# EAGLE design Haptic_Motor_Driver_DRV2605L (EAGLE 7.5.0)
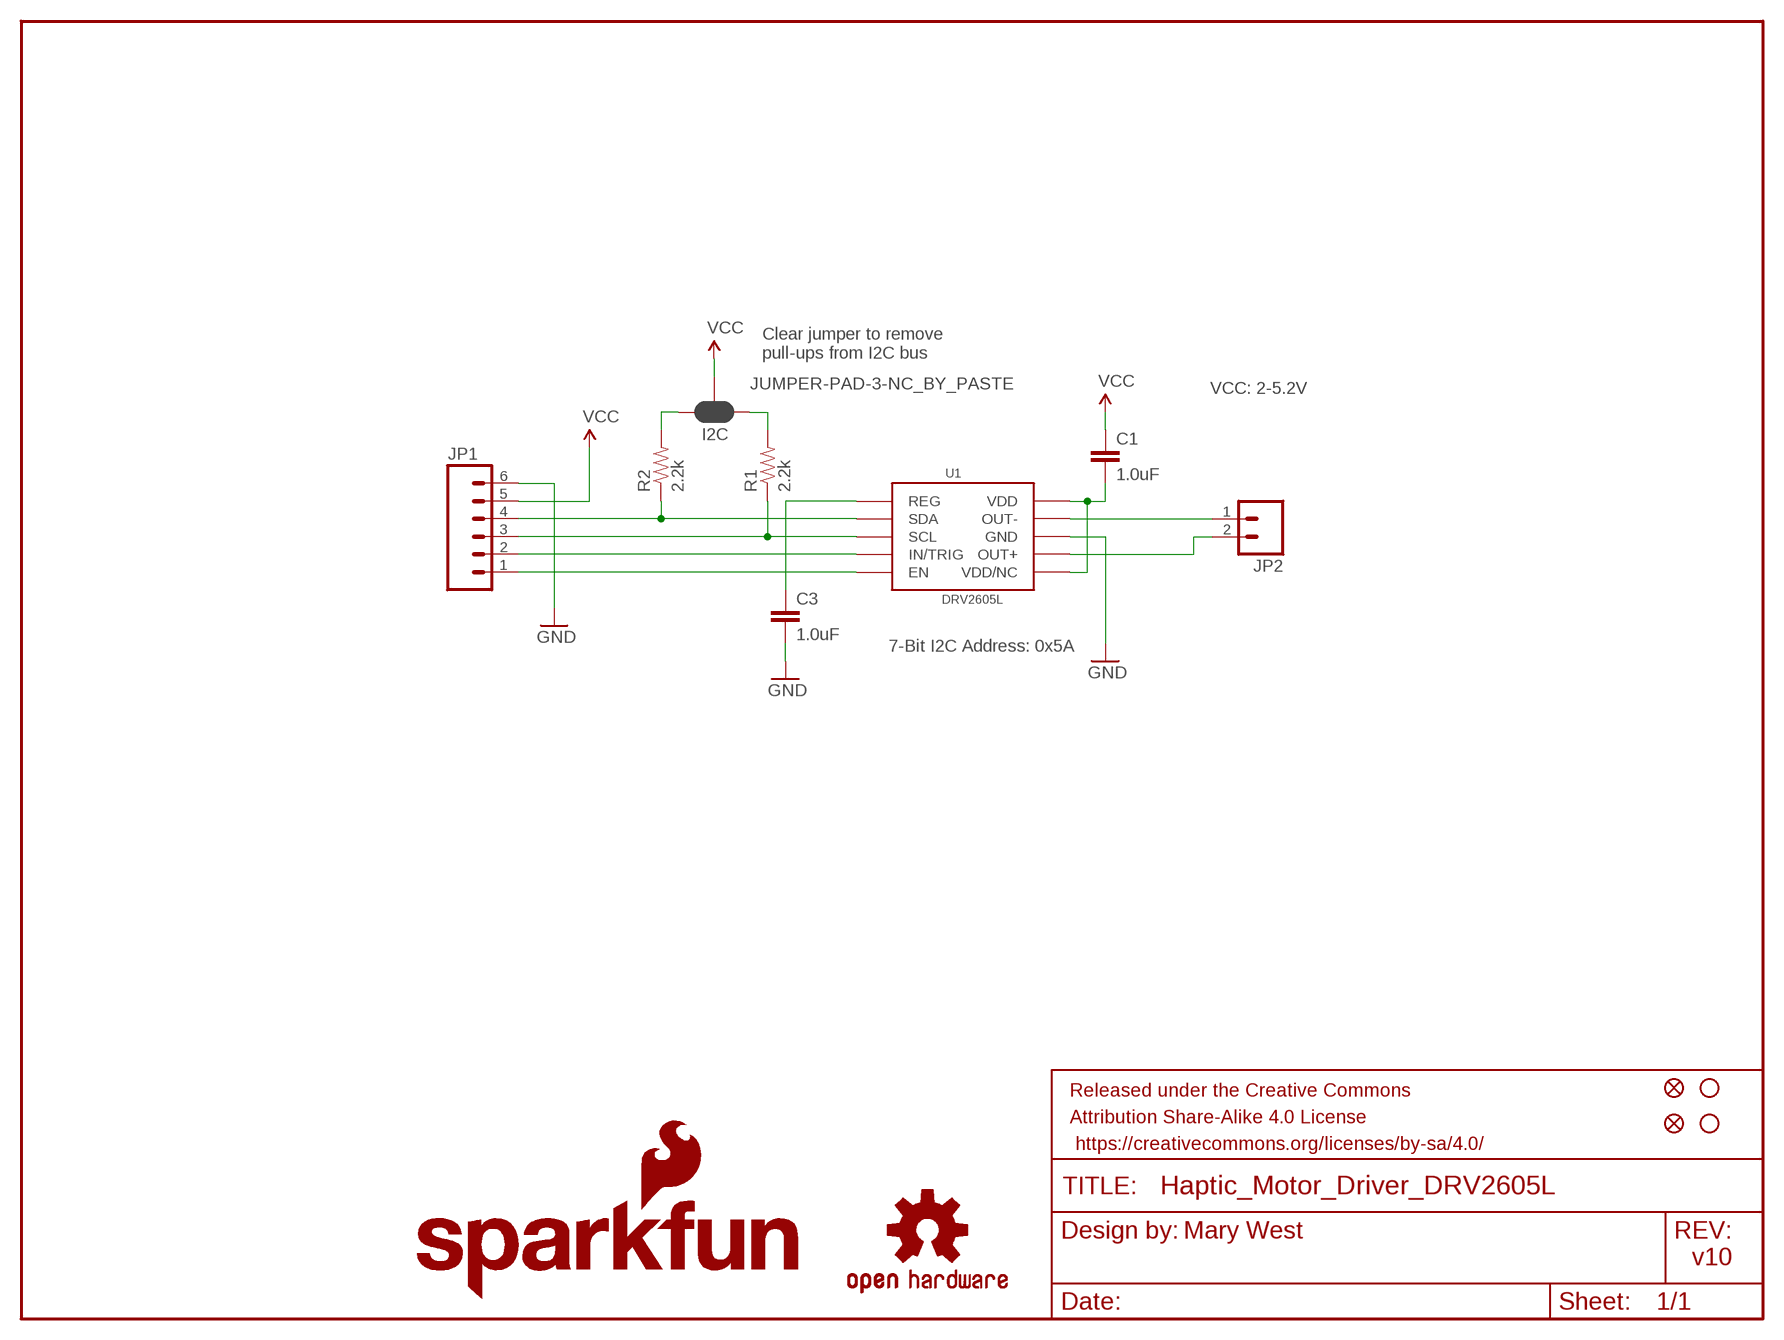
[diagram p0: schematic, sheet 1]

## Parts
C1  1.0uF  1.0UF-16V-10%(0402)  [0402-CAP]
C3  1.0uF  1.0UF-16V-10%(0402)  [0402-CAP]
FID1  FIDUCIAL1X2  [FIDUCIAL-1X2]
FID2  FIDUCIAL1X2  [FIDUCIAL-1X2]
FRAME2  FRAME-LETTER  [CREATIVE_COMMONS]
I2C  JUMPER-PAD-3-NC_BY_PASTE  [PAD-JUMPER-3-NC_BY_PASTE_YES_SILK_FULL_BOX]
JP1  M06SILK_FEMALE_PTH  [1X06]
JP2  M02PTH  [1X02]
LOGO2  OSHW-LOGOS  [OSHW-LOGO-S]
LOGO4  SFE_LOGO_NAME_FLAME.1_INCH  [SFE_LOGO_NAME_FLAME_.1]
R1  2.2k  2.2KOHM-1/10W-1%(0603)  [0603-RES]
R2  2.2k  2.2KOHM-1/10W-1%(0603)  [0603-RES]
STANDOFF1  STAND-OFF  [STAND-OFF]
STANDOFF4  STAND-OFF  [STAND-OFF]
U1  DRV2605L  [VSSOP-10]

## Nets
GND: C3.2 JP1.6 U1.P$8(GND)
N$1: JP1.4 R2.1 U1.P$3(SDA)
N$2: JP1.3 R1.1 U1.P$2(SCL)
N$3: C3.1 U1.P$1(REG)
N$4: JP1.2 U1.P$4(IN/TRIG)
N$5: JP1.1 U1.P$5(EN)
N$6: JP2.1 U1.P$9(OUT-)
N$7: JP2.2 U1.P$7(OUT+)
N$8: I2C.3 R2.2
N$9: I2C.1 R1.2
N$10: C1.2 U1.P$6(VDD/NC) U1.P$10(VDD)
VCC: C1.1 I2C.2 JP1.5

## Notes on the sheet
- Clear jumper to remove
  pull-ups from I2C bus
- VCC: 2-5.2V
- 7-Bit I2C Address: 0x5A
- Mary West
- v10

## Library data of the parts
C1 C3 = SparkFun-Capacitors:1.0UF-16V-10%(0402); PROD_ID: CAP-12417
FID1 FID2 = SparkFun-Aesthetics:FIDUCIAL: Fiducial Alignment Points Various fiducial points for machine vision alignment.
FRAME2 = SparkFun-Aesthetics:FRAME-LETTER: Schematic Frame Standard 8.5x11 US Letter frame
I2C = SparkFun-Passives:JUMPER-PAD-3-NC_BY_PASTE
JP1 = SparkFun-Connectors:M06: Header 6 Standard 6-pin 0.1" header. Use with straight break away headers (SKU : PRT-00116), right angle break away headers (PRT-00553), swiss pins (PRT-00743), machine pins (PRT-00117), and female headers (PRT-00115). Molex polarized connector foot print use with SKU : PRT-08094 with associated crimp pins and housings. NOTES ON THE VARIANTS LOCK and LOCK_LONGPADS... This footprint was designed to help hold the alignment of a through-hole component (i.e. 6-pin header) while soldering it into place. You may notice that each hole has been shifted either up or down by 0.005 of an inch from it's more standard position (which is a perfectly straight line). This slight alteration caused the pins (the squares in the middle) to touch the edges of the holes. Because they are alternating, it causes a "brace" to hold the component in place. 0.005 has proven to be the perfect amount of "off-center" position when using our standard breakaway headers. Although looks a little odd when you look at the bare footprint, once you have a header in there, the alteration is very hard to notice. Also,if you push a header all the way into place, it is covered up entirely on the bottom side. This idea of altering the position of holes to aid alignment will be further integrated into the Sparkfun Library for other footprints. It can help hold any component with 3 or more connection pins.; PROD_ID: CONN-08437
JP2 = SparkFun-Connectors:M02: Standard 2-pin 0.1" header. Use with - straight break away headers ( PRT-00116) - right angle break away headers (PRT-00553) - swiss pins (PRT-00743) - machine pins (PRT-00117) - female headers (PRT-00115) Molex polarized connector foot print use with: PRT-08233 with associated crimp pins and housings. 2.54_SCREWTERM for use with PRT-10571. 3.5mm Screw Terminal footprints for PRT-08084 5mm Screw Terminal footprints for use with PRT-08432
LOGO2 = SparkFun-Aesthetics:OSHW-LOGO: Open Source Hardware Logo This logo indicates the piece of hardware it is found on incorporates a OSHW license and/or adheres to the definition of open source hardware found here: http://freedomdefined.org/OSHW
LOGO4 = SparkFun-Aesthetics:SFE_LOGO_NAME_FLAME: SFE Logo, name and flame This is the SparkFun full logo. The logo on the schematic will always be the same size; the package variant is the height of the flame part of the logo. Default layer for the logo on the board is tSilk.
R1 R2 = SparkFun-Resistors:2.2KOHM-1/10W-1%(0603): RES-08272; PROD_ID: RES-08272
STANDOFF1 STANDOFF4 = SparkFun-Electromechanical:STAND-OFF: #4 Stand Off This is the mechanical footprint for a #4 phillips button head screw. Use the keepout ring to avoid running the screw head into surrounding components. SKU : PRT-00447
U1 = SparkFun-PowerIC:DRV2605L; PROD_ID: IC-13504

## Net classes
1 power: width 0.102 mm

## Board
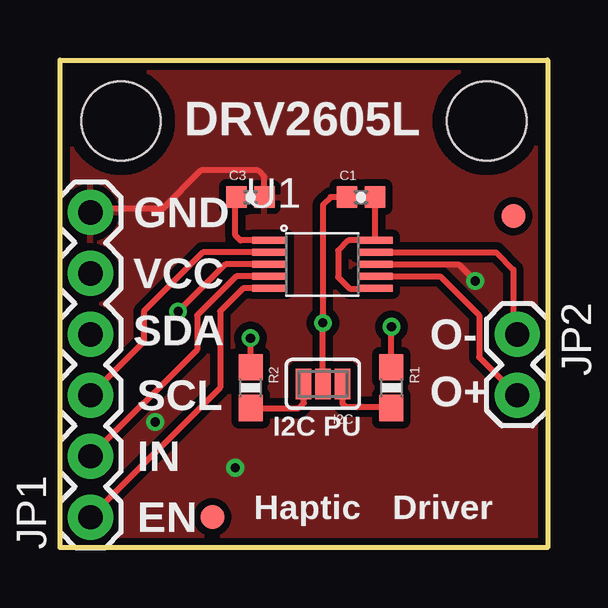
[diagram p1: board, top side]
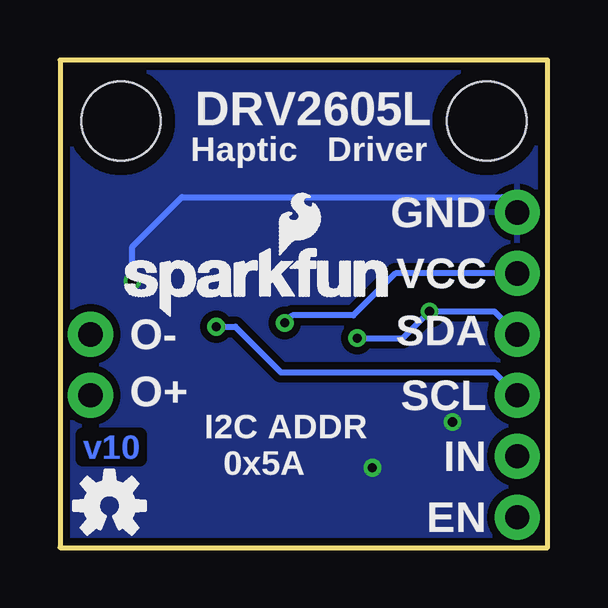
[diagram p2: board, bottom side, seen from below]

Size 20.32 x 20.32 mm. Coordinates in mm from the lower left corner, seen from the top.
Outline: 20.32,0 0,0 0,20.32 20.32,20.32 20.32,0
Copper layers (1*16): Top 0.035mm / dielectric 1.5mm / Bottom 0.035mm
Design rules "SparkFun-2-layer-TIGHT": minimum track width 7mil, minimum drill 15mil, track to track 7mil, track to pad 7mil, pad to pad 7mil, via to via 7mil, smd to smd 7mil, copper to edge 7mil, drill to drill 7mil, minimum pad ring 7mil, minimum via ring 7mil, stop-mask expansion 4mil, vias tented up to drill 25mil, thermal gap 10mil

### Footprints (pad centres in the part's own frame; a part is rotated, then mirrored left to right if it is on the bottom)
0402-CAP = smd 0.85 x 0.9: 1 -0.58,0; 2 0.58,0
FIDUCIAL-1X2 = smd 1 x 1: 1 0,0
PAD-JUMPER-3-NC_BY_PASTE_YES_SILK_FULL_BOX = smd 0.635 x 1.27: 1 -0.813,0; 2 0,0; 3 0.813,0
1X06 = drill 1.016 pad 1.88: 1 0,0; 2 2.54,0; 3 5.08,0; 4 7.62,0; 5 10.16,0; 6 12.7,0
1X02 = drill 1.016 pad 1.88: 1 0,0; 2 2.54,0
0603-RES = smd 1.1 x 1: 1 -0.85,0; 2 0.85,0
STAND-OFF = hole 3.302: 0,0
VSSOP-10 = smd 1.45 x 0.3: P$1 -1.905,1.06; P$2 -1.905,0.56; P$3 -1.905,0.06; P$4 -1.905,-0.44; P$5 -1.905,-0.94; P$6 2.495,-0.94; P$7 2.495,-0.44; P$8 2.495,0.06; P$9 2.495,0.56; P$10 2.495,1.06

### Placement (x,y rotation side)
C1  12.54,14.61 0 top
C3  7.94,14.61 0 top
FID1  6.35,1.27 0 top
FID2  18.89,13.81 0 top
FRAME2  -12.7,-13.97 0 top  (outside the outline)
I2C  10.95,6.83 180 top
JP1  1.27,1.27 90 top
JP2  19.05,8.89 270 top
LOGO2  18.26,1.75 0 bottom
LOGO4  18.03,9.56 0 bottom
R1  13.81,6.67 270 top
R2  7.94,6.67 270 top
STANDOFF1  17.78,17.78 0 top
STANDOFF4  2.54,17.78 0 top
U1  10.64,11.75 0 top

### Tracks (layer width: path | path; a pad name or v marks a point on that pad's centre or on a via)
GND  (via drill 0.38)
  Top 0.254: U1.P$8 16.61,11.81 v17.3,11.11 | C3.2 8.52,15.45 8.26,15.72 5.87,15.72 4.29,14.13 1.43,14.13 JP1.6
  Bottom 0.254: v17.3,11.11 17.3,12.54 15.24,14.61 1.91,14.61 JP1.6
  other vias: 7.3,3.33 3.97,5.24
  pour Top (isolate 0.305, rank 6): 20.32,20.32 0,20.32 0,0 20.32,0
  pour Bottom (isolate 0.305, rank 6): 20.32,20.32 0,20.32 0,0 20.32,0
N$1  (via drill 0.38)
  Top 0.254: U1.P$3 6.89,11.81 v4.92,9.84 | R2.1 v7.94,8.73
  Bottom 0.254: JP1.4 2.22,9.84 v4.92,9.84 6.03,8.73 v7.94,8.73
N$2  (via drill 0.38)
  Top 0.254: U1.P$2 5.96,12.31 3.49,9.84 3.49,8.57 JP1.3 | R1.1 v13.81,9.21
  Bottom 0.254: v13.81,9.21 13.02,9.21 11.11,7.3 2.22,7.3 JP1.3
N$3
  Top 0.254: U1.P$1 7.51,12.81 7.3,13.02 7.3,14.55 C3.1
N$4
  Top 0.254: U1.P$4 7.34,11.31 5.71,9.68 5.71,8.26 JP1.2
N$5
  Top 0.254: U1.P$5 7.63,10.81 6.67,9.84 6.67,6.67 JP1.1
N$6
  Top 0.254: U1.P$9 18.17,12.31 18.89,11.59 18.89,9.05 JP2.1
N$7
  Top 0.254: U1.P$7 15.84,11.31 17.46,9.68 17.46,7.94 JP2.2
N$8
  Top 0.254: R2.2 9.95,5.82 10.16,6.03 10.16,6.81 I2C.3
N$9
  Top 0.254: I2C.1 11.77,6.01 11.91,5.87 13.76,5.87 R1.2
N$10
  Top 0.254: U1.P$6 13.12,10.79 12.06,10.79 11.59,11.27 11.59,12.38 12.01,12.81 U1.P$10 13.13,14.6 C1.2
VCC  (via drill 0.38)
  Top 0.254: I2C.2 v10.95,9.37 10.95,14.29 11.27,14.61 C1.1
  Bottom 0.254: JP1.5 6.35,11.43 8.1,9.68 10.64,9.68 v10.95,9.37

### Text on the board
Bottom: v10
tPlace: DRV2605L | GND | VCC | SDA | O- | SCL | O+ | I2C PU | IN | EN | Haptic | Driver
bPlace: DRV2605L | Driver | Haptic | GND | VCC | SDA | O- | SCL | O+ | IN | I2C ADDR / 0x5A | EN
Measures: All Units in Inches
tDocu: Mary West